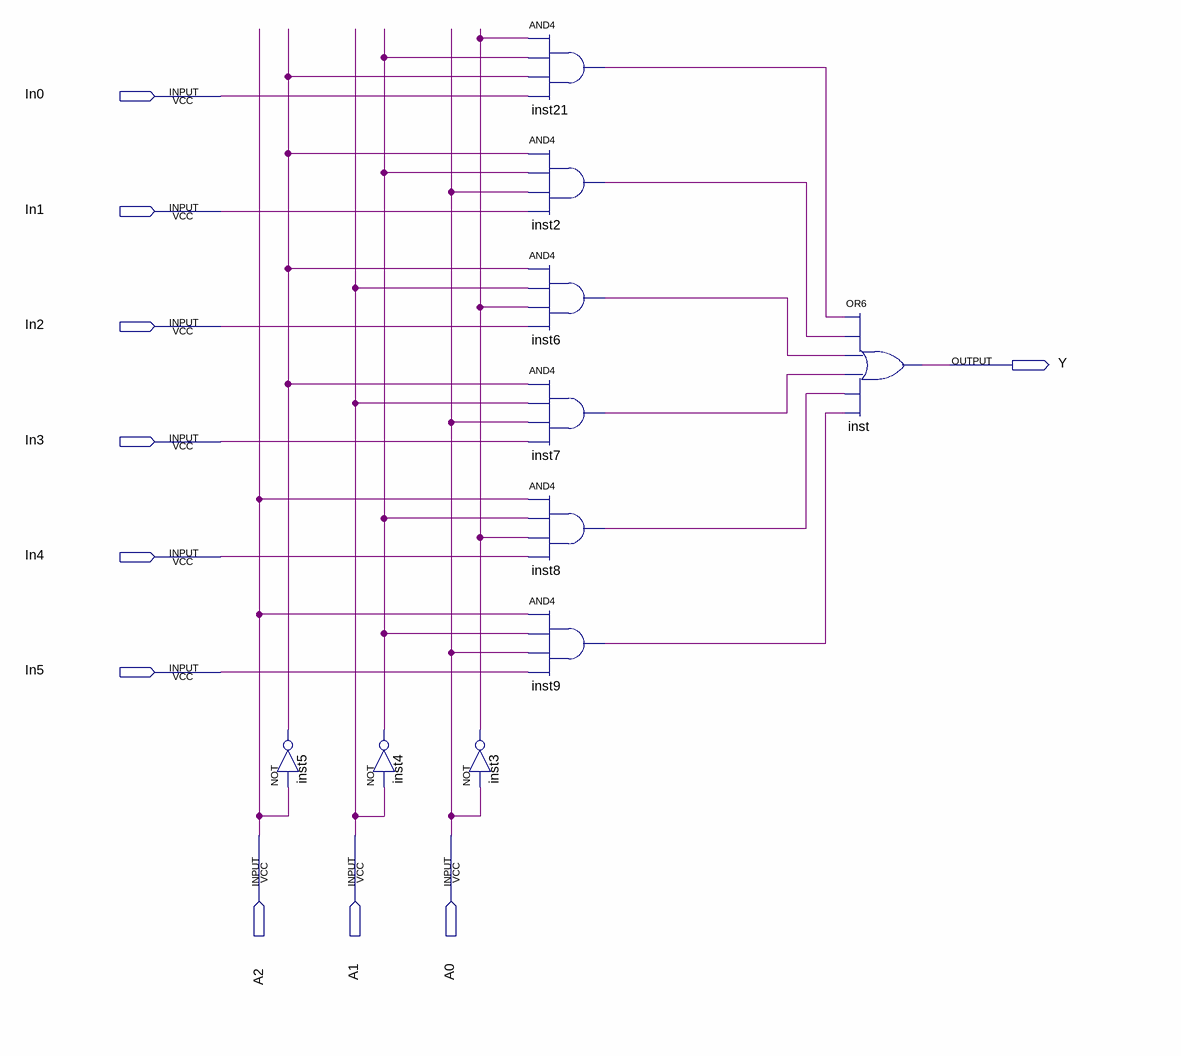
[diagram p0: schematic sheet]
// Quartus schematic MUX61.bdf as structural Verilog: 10 symbols, 10 pins
module MUX61 (
  input  In0,
  input  In1,
  input  In2,
  input  In3,
  input  In4,
  input  In5,
  input  A2,
  input  A1,
  input  A0,
  output Y
);

  wire inst2_out, inst3_out, inst4_out, inst5_out, inst6_out, inst7_out, inst8_out, inst9_out, inst21_out;

  not inst5 (inst5_out, A2);
  not inst4 (inst4_out, A1);
  not inst3 (inst3_out, A0);
  and inst21 (inst21_out, inst3_out, inst4_out, inst5_out, In0);
  and inst2 (inst2_out, inst5_out, inst4_out, A0, In1);
  and inst6 (inst6_out, inst5_out, A1, inst3_out, In2);
  and inst7 (inst7_out, inst5_out, A1, A0, In3);
  and inst8 (inst8_out, A2, inst4_out, inst3_out, In4);
  and inst9 (inst9_out, A2, inst4_out, A0, In5);
  or inst (Y, inst21_out, inst2_out, inst6_out, inst7_out, inst8_out, inst9_out);
endmodule
